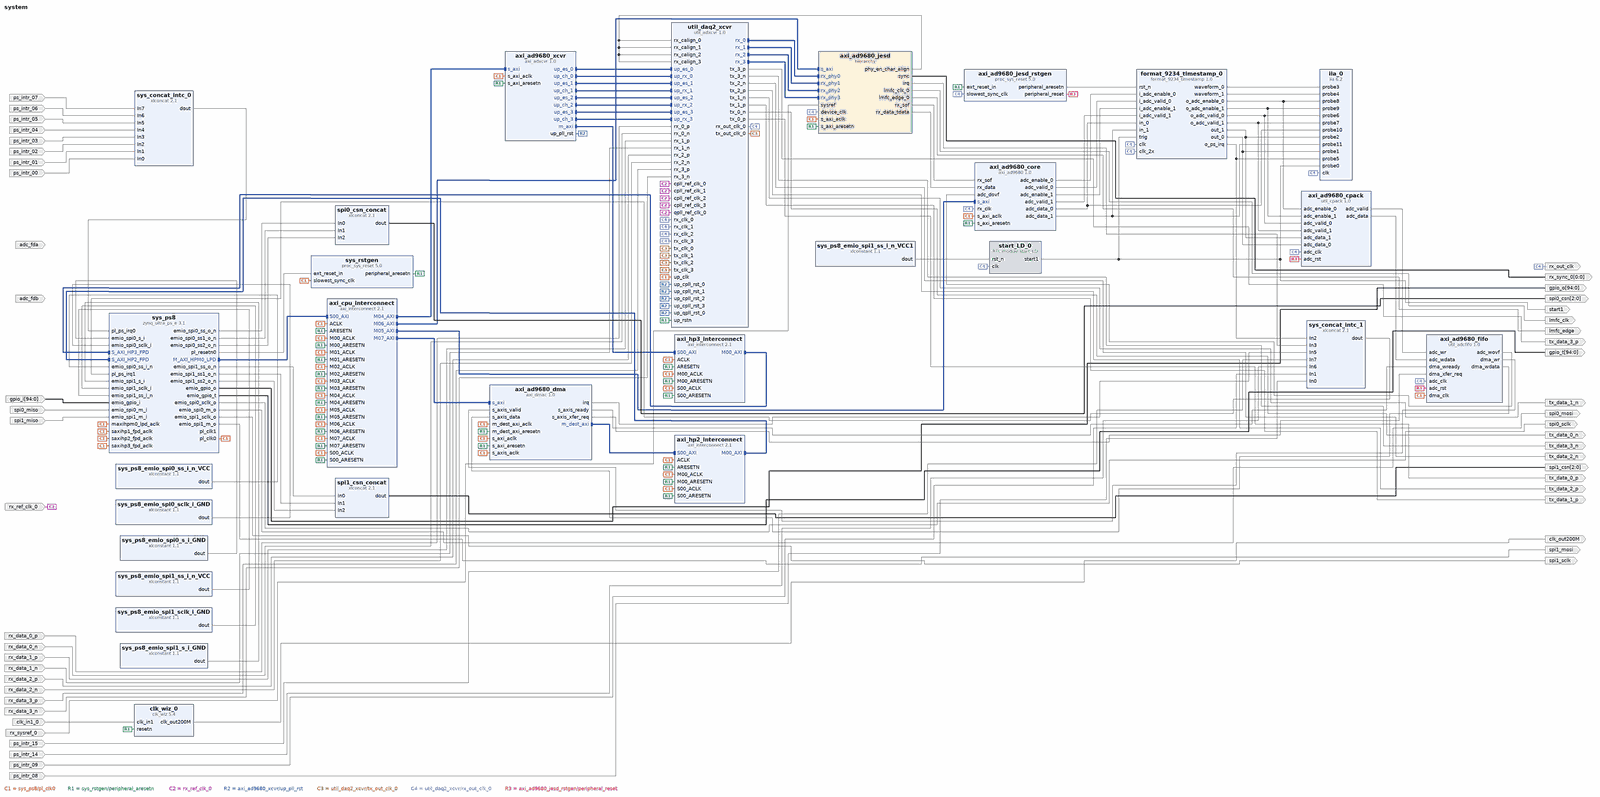
[diagram p0: block diagram of the top level, whole]
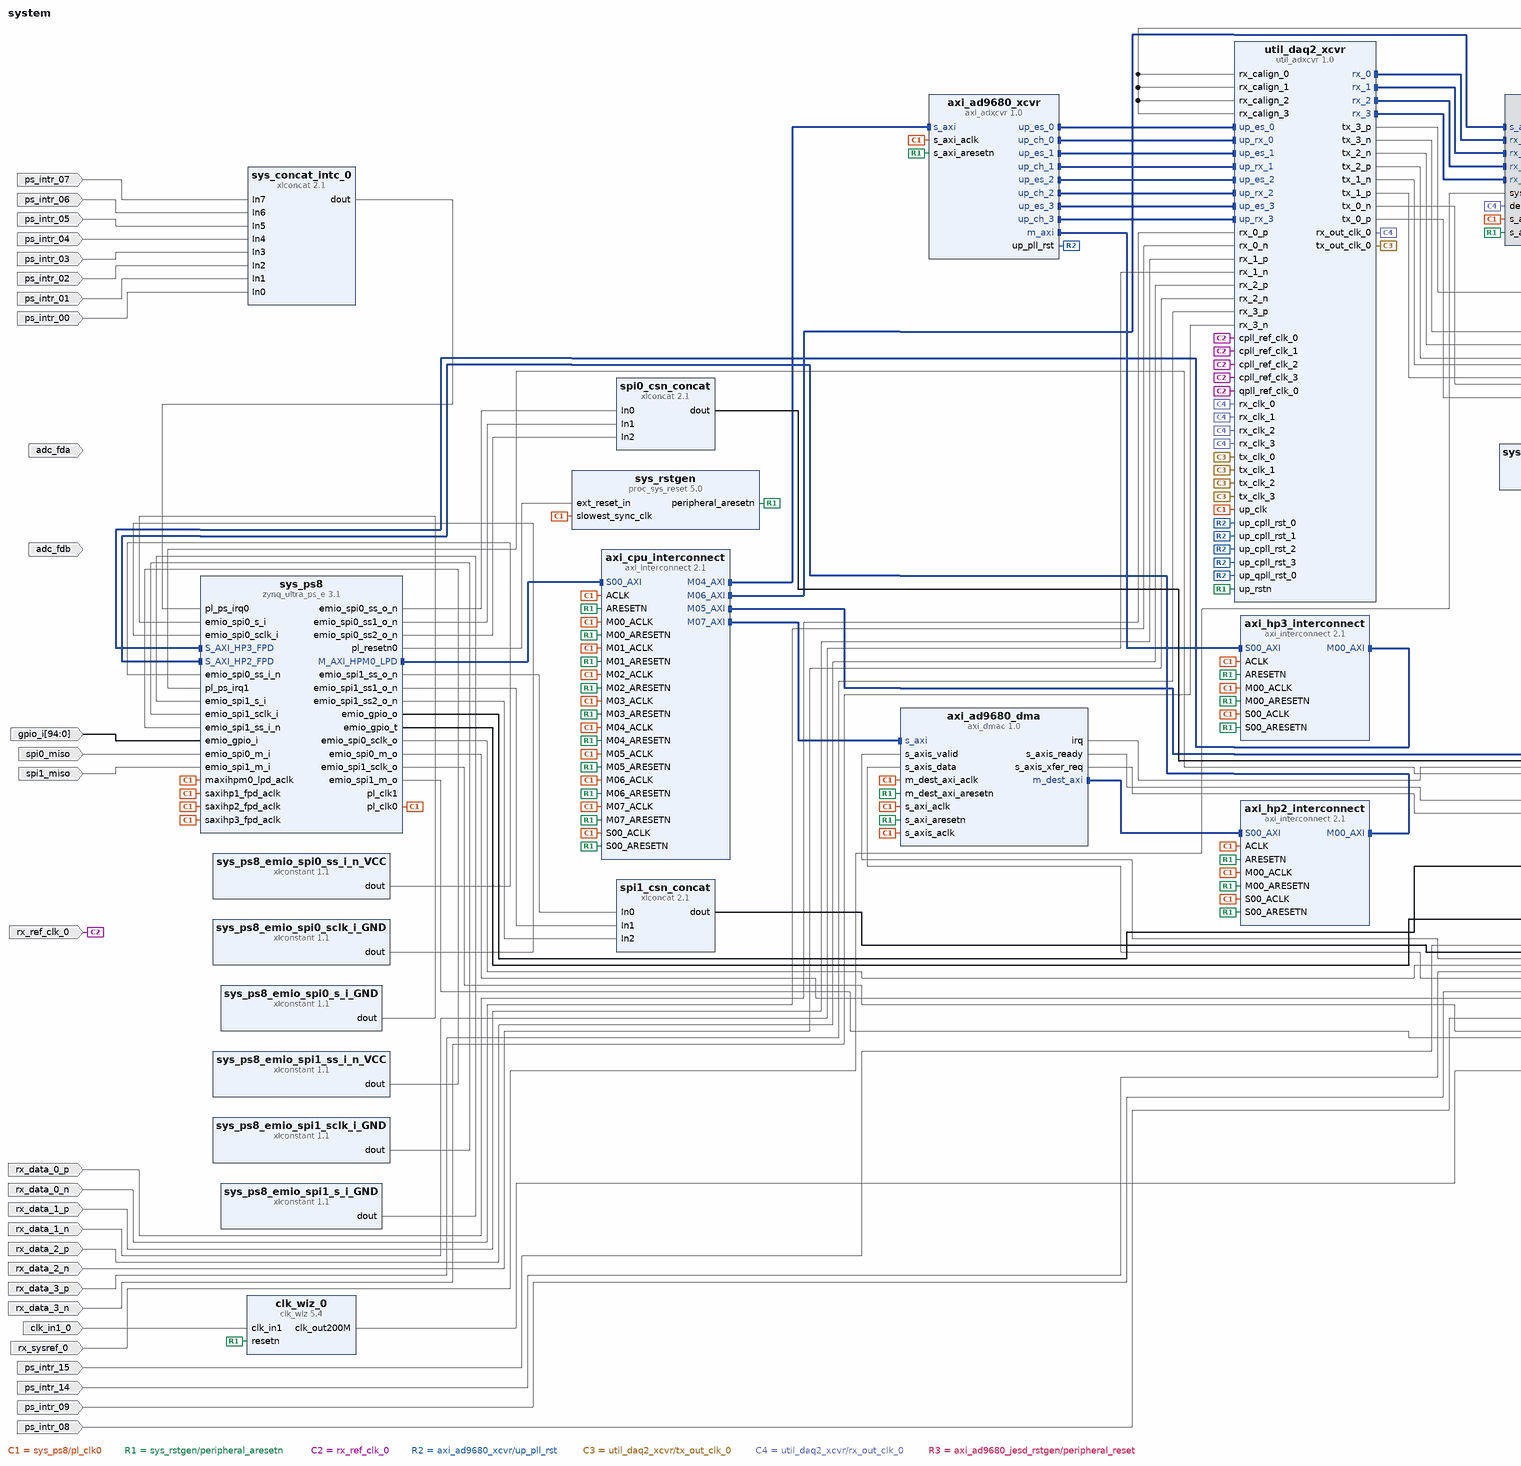
[diagram p1: block diagram of the top level, left part]
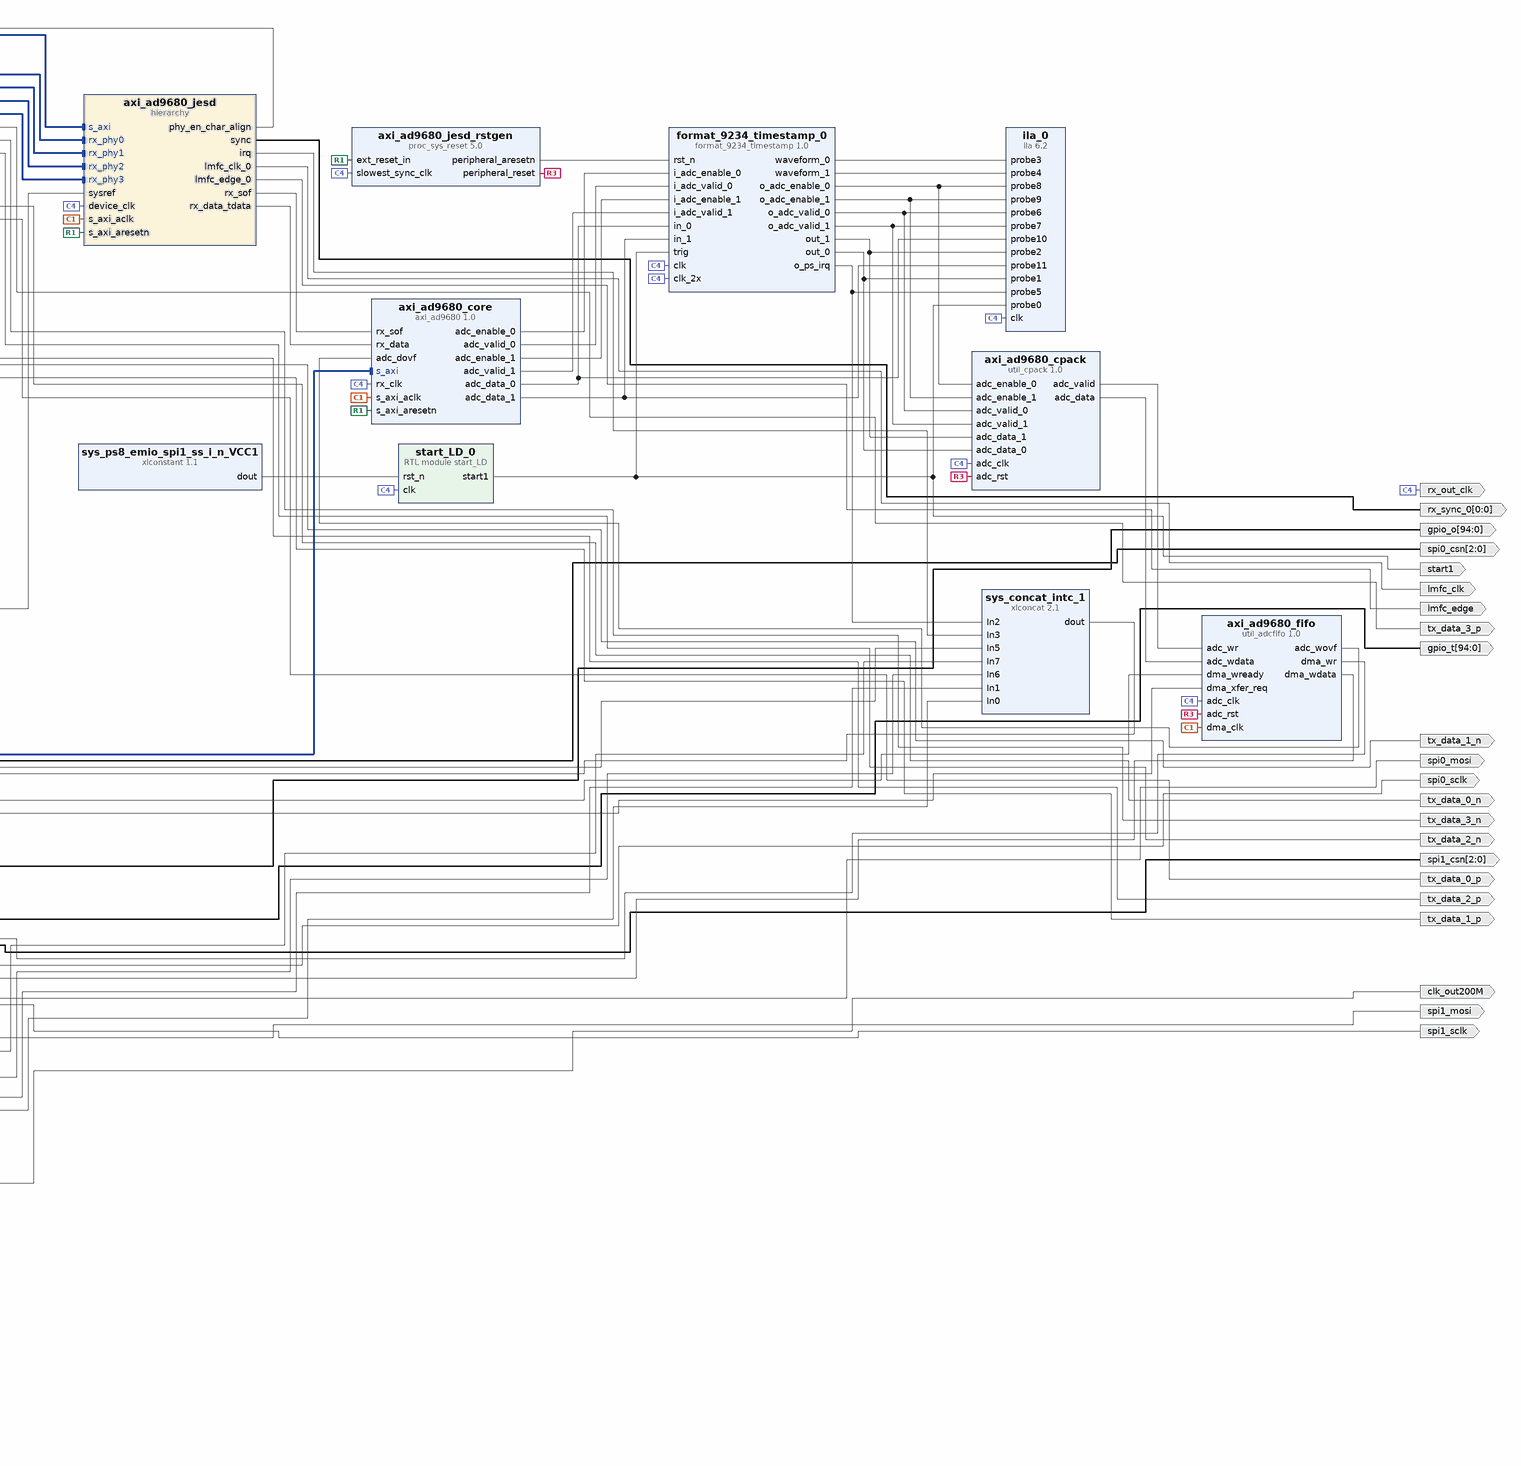
[diagram p2: block diagram of the top level, right part]
# Vivado block design system, xczu9eg-ffvb1156-2-e, Vivado 2017.4
create_bd_design system

create_bd_port -dir I -from 94 -to 0 gpio_i
create_bd_port -dir O -from 94 -to 0 gpio_o
create_bd_port -dir O -from 94 -to 0 gpio_t
create_bd_port -dir O -from 2 -to 0 spi0_csn
create_bd_port -dir O spi0_sclk
create_bd_port -dir O spi0_mosi
create_bd_port -dir I spi0_miso
create_bd_port -dir O -from 2 -to 0 spi1_csn
create_bd_port -dir O spi1_sclk
create_bd_port -dir O spi1_mosi
create_bd_port -dir I spi1_miso
create_bd_port -dir I -type intr ps_intr_15
create_bd_port -dir I -type intr ps_intr_14
create_bd_port -dir I -type intr ps_intr_09
create_bd_port -dir I -type intr ps_intr_08
create_bd_port -dir I -type intr ps_intr_07
create_bd_port -dir I -type intr ps_intr_06
create_bd_port -dir I -type intr ps_intr_05
create_bd_port -dir I -type intr ps_intr_04
create_bd_port -dir I -type intr ps_intr_03
create_bd_port -dir I -type intr ps_intr_02
create_bd_port -dir I -type intr ps_intr_01
create_bd_port -dir I -type intr ps_intr_00
create_bd_port -dir I rx_ref_clk_0
create_bd_port -dir O tx_data_3_p
create_bd_port -dir O tx_data_3_n
create_bd_port -dir O -type clk rx_out_clk
create_bd_port -dir I rx_data_0_p
create_bd_port -dir I rx_data_0_n
create_bd_port -dir I rx_data_1_p
create_bd_port -dir I rx_data_1_n
create_bd_port -dir I rx_data_2_p
create_bd_port -dir I rx_data_2_n
create_bd_port -dir I rx_data_3_p
create_bd_port -dir I rx_data_3_n
create_bd_port -dir I rx_sysref_0
create_bd_port -dir O -from 0 -to 0 rx_sync_0
create_bd_port -dir O -type data start1
create_bd_port -dir O tx_data_2_n
create_bd_port -dir O tx_data_2_p
create_bd_port -dir O tx_data_1_n
create_bd_port -dir O tx_data_1_p
create_bd_port -dir O tx_data_0_n
create_bd_port -dir O tx_data_0_p
create_bd_port -dir O -type clk clk_out200M
set_property -dict {CONFIG.FREQ_HZ 200000000} [get_bd_ports clk_out200M]
create_bd_port -dir I -type clk clk_in1_0
create_bd_port -dir I adc_fda
create_bd_port -dir I adc_fdb
create_bd_port -dir O lmfc_clk
create_bd_port -dir O lmfc_edge

create_bd_cell -type ip -vlnv xilinx.com:ip:zynq_ultra_ps_e:3.1 sys_ps8
set_property -dict [list \
  CONFIG.PSU__PSS_REF_CLK__FREQMHZ 33.330 \
  CONFIG.PSU__CAN1__PERIPHERAL__ENABLE 1 \
  CONFIG.PSU__CAN1__PERIPHERAL__IO {MIO 24 .. 25} \
  CONFIG.PSU__DPAUX__PERIPHERAL__ENABLE 1 \
  CONFIG.PSU__DPAUX__PERIPHERAL__IO {MIO 27 .. 30} \
  CONFIG.PSU__GEM__TSU__ENABLE 0 \
  CONFIG.PSU__FPGA_PL0_ENABLE 1 \
  CONFIG.PSU__FPGA_PL1_ENABLE 1 \
  CONFIG.PSU__ENET3__PERIPHERAL__ENABLE 1 \
  CONFIG.PSU__ENET3__FIFO__ENABLE 0 \
  CONFIG.PSU__ENET3__PTP__ENABLE 0 \
  CONFIG.PSU__ENET3__PERIPHERAL__IO {MIO 64 .. 75} \
  CONFIG.PSU__ENET3__GRP_MDIO__ENABLE 1 \
  CONFIG.PSU__ENET3__GRP_MDIO__IO {MIO 76 .. 77} \
  CONFIG.PSU__GPIO_EMIO__PERIPHERAL__ENABLE 1 \
  CONFIG.PSU__GPIO_EMIO__PERIPHERAL__IO 95 \
  CONFIG.PSU__GPIO0_MIO__PERIPHERAL__ENABLE 1 \
  CONFIG.PSU__GPIO0_MIO__IO {MIO 0 .. 25} \
  CONFIG.PSU__GPIO1_MIO__PERIPHERAL__ENABLE 1 \
  CONFIG.PSU__GPIO1_MIO__IO {MIO 26 .. 51} \
  CONFIG.PSU__I2C0__PERIPHERAL__ENABLE 1 \
  CONFIG.PSU__I2C0__PERIPHERAL__IO {MIO 14 .. 15} \
  CONFIG.PSU__I2C1__PERIPHERAL__ENABLE 1 \
  CONFIG.PSU__I2C1__PERIPHERAL__IO {MIO 16 .. 17} \
  CONFIG.PSU__PCIE__PERIPHERAL__ENABLE 1 \
  CONFIG.PSU__PCIE__PERIPHERAL__ENDPOINT_ENABLE 0 \
  CONFIG.PSU__PCIE__PERIPHERAL__ROOTPORT_ENABLE 1 \
  CONFIG.PSU__PCIE__PERIPHERAL__ROOTPORT_IO {MIO 31} \
  CONFIG.PSU__PCIE__LANE0__ENABLE 1 \
  CONFIG.PSU__PCIE__LANE0__IO {GT Lane0} \
  CONFIG.PSU__GT__LINK_SPEED HBR \
  CONFIG.PSU__GT__VLT_SWNG_LVL_4 0 \
  CONFIG.PSU__GT__PRE_EMPH_LVL_4 0 \
  CONFIG.PSU__USB0__REF_CLK_SEL {Ref Clk2} \
  CONFIG.PSU__USB0__REF_CLK_FREQ 26 \
  CONFIG.PSU__DP__REF_CLK_SEL {Ref Clk3} \
  CONFIG.PSU__DP__REF_CLK_FREQ 27 \
  CONFIG.PSU__SATA__REF_CLK_SEL {Ref Clk1} \
  CONFIG.PSU__SATA__REF_CLK_FREQ 125 \
  CONFIG.PSU__PCIE__REF_CLK_SEL {Ref Clk0} \
  CONFIG.PSU__PCIE__REF_CLK_FREQ 100 \
  CONFIG.PSU__DP__LANE_SEL {Single Lower} \
  CONFIG.PSU__PCIE__DEVICE_PORT_TYPE {Root Port} \
  CONFIG.PSU__PCIE__MAXIMUM_LINK_WIDTH x1 \
  CONFIG.PSU__PCIE__LINK_SPEED {5.0 Gb/s} \
  CONFIG.PSU__PCIE__BAR0_VAL 0x0 \
  CONFIG.PSU__PCIE__BAR1_VAL 0x0 \
  CONFIG.PSU__PCIE__BAR2_VAL 0x0 \
  CONFIG.PSU__PCIE__BAR3_VAL 0x0 \
  CONFIG.PSU__PCIE__BAR4_VAL 0x0 \
  CONFIG.PSU__PCIE__BAR5_VAL 0x0 \
  CONFIG.PSU__PCIE__EROM_VAL 0x0 \
  CONFIG.PSU__PCIE__MAX_PAYLOAD_SIZE {256 bytes} \
  CONFIG.PSU__PCIE__VENDOR_ID 0x10EE \
  CONFIG.PSU__PCIE__DEVICE_ID 0xD021 \
  CONFIG.PSU__PCIE__REVISION_ID 0x0 \
  CONFIG.PSU__PCIE__SUBSYSTEM_VENDOR_ID 0x10EE \
  CONFIG.PSU__PCIE__SUBSYSTEM_ID 0x7 \
  CONFIG.PSU__PCIE__CLASS_CODE_BASE 0x06 \
  CONFIG.PSU__PCIE__CLASS_CODE_SUB 0x4 \
  CONFIG.PSU__PCIE__CLASS_CODE_INTERFACE 0x0 \
  CONFIG.PSU__PCIE__CLASS_CODE_VALUE 0x60400 \
  CONFIG.PSU__PCIE__CRS_SW_VISIBILITY 1 \
  CONFIG.PSU__PMU__AIBACK__ENABLE 0 \
  CONFIG.PSU__PMU__PLERROR__ENABLE 0 \
  CONFIG.PSU__PMU__PERIPHERAL__ENABLE 1 \
  CONFIG.PSU__PMU__EMIO_GPI__ENABLE 0 \
  CONFIG.PSU__PMU__EMIO_GPO__ENABLE 0 \
  CONFIG.PSU__PMU__GPI0__ENABLE 0 \
  CONFIG.PSU__PMU__GPI1__ENABLE 0 \
  CONFIG.PSU__PMU__GPI2__ENABLE 0 \
  CONFIG.PSU__PMU__GPI3__ENABLE 0 \
  CONFIG.PSU__PMU__GPI4__ENABLE 0 \
  CONFIG.PSU__PMU__GPI5__ENABLE 0 \
  CONFIG.PSU__PMU__GPO0__ENABLE 1 \
  CONFIG.PSU__PMU__GPO1__ENABLE 1 \
  CONFIG.PSU__PMU__GPO2__ENABLE 1 \
  CONFIG.PSU__PMU__GPO3__ENABLE 1 \
  CONFIG.PSU__PMU__GPO4__ENABLE 1 \
  CONFIG.PSU__PMU__GPO5__ENABLE 1 \
  CONFIG.PSU__PMU__GPO0__IO {MIO 32} \
  CONFIG.PSU__PMU__GPO1__IO {MIO 33} \
  CONFIG.PSU__PMU__GPO2__IO {MIO 34} \
  CONFIG.PSU__PMU__GPO3__IO {MIO 35} \
  CONFIG.PSU__PMU__GPO4__IO {MIO 36} \
  CONFIG.PSU__PMU__GPO5__IO {MIO 37} \
  CONFIG.PSU__QSPI__PERIPHERAL__ENABLE 1 \
  CONFIG.PSU__QSPI__PERIPHERAL__IO {MIO 0 .. 12} \
  CONFIG.PSU__QSPI__PERIPHERAL__MODE {Dual Parallel} \
  CONFIG.PSU__QSPI__PERIPHERAL__DATA_MODE x4 \
  CONFIG.PSU__QSPI__GRP_FBCLK__ENABLE 1 \
  CONFIG.PSU__QSPI__GRP_FBCLK__IO {MIO 6} \
  CONFIG.PSU__SD1__PERIPHERAL__ENABLE 1 \
  CONFIG.PSU__SD1__PERIPHERAL__IO {MIO 39 .. 51} \
  CONFIG.PSU__SD1__GRP_CD__ENABLE 1 \
  CONFIG.PSU__SD1__GRP_CD__IO {MIO 45} \
  CONFIG.PSU__SD1__GRP_POW__ENABLE 0 \
  CONFIG.PSU__SD1__GRP_WP__ENABLE 1 \
  CONFIG.PSU__SD1__GRP_WP__IO {MIO 44} \
  CONFIG.PSU__SD1__SLOT_TYPE {SD 3.0} \
  CONFIG.PSU__SD1__DATA_TRANSFER_MODE 8Bit \
  CONFIG.PSU__SPI0__PERIPHERAL__ENABLE 1 \
  CONFIG.PSU__SPI0__PERIPHERAL__IO EMIO \
  CONFIG.PSU__SPI0__GRP_SS0__IO EMIO \
  CONFIG.PSU__SPI0__GRP_SS1__ENABLE 1 \
  CONFIG.PSU__SPI0__GRP_SS1__IO EMIO \
  CONFIG.PSU__SPI0__GRP_SS2__ENABLE 1 \
  CONFIG.PSU__SPI0__GRP_SS2__IO EMIO \
  CONFIG.PSU__SPI1__PERIPHERAL__ENABLE 1 \
  CONFIG.PSU__SPI1__PERIPHERAL__IO EMIO \
  CONFIG.PSU__SPI1__GRP_SS0__IO EMIO \
  CONFIG.PSU__SPI1__GRP_SS1__ENABLE 1 \
  CONFIG.PSU__SPI1__GRP_SS1__IO EMIO \
  CONFIG.PSU__SPI1__GRP_SS2__ENABLE 1 \
  CONFIG.PSU__SPI1__GRP_SS2__IO EMIO \
  CONFIG.PSU__SWDT0__PERIPHERAL__ENABLE 1 \
  CONFIG.PSU__SWDT0__CLOCK__ENABLE 0 \
  CONFIG.PSU__SWDT0__RESET__ENABLE 0 \
  CONFIG.PSU__SWDT1__PERIPHERAL__ENABLE 1 \
  CONFIG.PSU__SWDT1__CLOCK__ENABLE 0 \
  CONFIG.PSU__SWDT1__RESET__ENABLE 0 \
  CONFIG.PSU__UART0__BAUD_RATE 115200 \
  CONFIG.PSU__TTC0__PERIPHERAL__ENABLE 1 \
  CONFIG.PSU__TTC0__CLOCK__ENABLE 0 \
  CONFIG.PSU__TTC0__WAVEOUT__ENABLE 0 \
  CONFIG.PSU__TTC1__PERIPHERAL__ENABLE 1 \
  CONFIG.PSU__UART1__BAUD_RATE 115200 \
  CONFIG.PSU__TTC1__CLOCK__ENABLE 0 \
  CONFIG.PSU__TTC1__WAVEOUT__ENABLE 0 \
  CONFIG.PSU__TTC2__PERIPHERAL__ENABLE 1 \
  CONFIG.PSU__TTC2__CLOCK__ENABLE 0 \
  CONFIG.PSU__TTC2__WAVEOUT__ENABLE 0 \
  CONFIG.PSU__TTC3__PERIPHERAL__ENABLE 1 \
  CONFIG.PSU__TTC3__CLOCK__ENABLE 0 \
  CONFIG.PSU__TTC3__WAVEOUT__ENABLE 0 \
  CONFIG.PSU__CSUPMU__PERIPHERAL__VALID 1 \
  CONFIG.PSU__DDRC__BUS_WIDTH {64 Bit} \
  CONFIG.PSU__DDRC__DEVICE_CAPACITY {4096 MBits} \
  CONFIG.PSU__DDRC__DRAM_WIDTH {8 Bits} \
  CONFIG.PSU__DDRC__ECC Disabled \
  CONFIG.PSU__DDRC__MEMORY_TYPE {DDR 4} \
  CONFIG.PSU__DDRC__SPEED_BIN DDR4_2133P \
  CONFIG.PSU__DDRC__COMPONENTS UDIMM \
  CONFIG.PSU__UART0__PERIPHERAL__ENABLE 1 \
  CONFIG.PSU__UART0__PERIPHERAL__IO {MIO 18 .. 19} \
  CONFIG.PSU__UART0__MODEM__ENABLE 0 \
  CONFIG.PSU__UART1__PERIPHERAL__ENABLE 1 \
  CONFIG.PSU__UART1__PERIPHERAL__IO {MIO 20 .. 21} \
  CONFIG.PSU__UART1__MODEM__ENABLE 0 \
  CONFIG.PSU__USB0__PERIPHERAL__ENABLE 1 \
  CONFIG.PSU__USB0__PERIPHERAL__IO {MIO 52 .. 63} \
  CONFIG.PSU__USB3_0__PERIPHERAL__ENABLE 1 \
  CONFIG.PSU__USB3_0__PERIPHERAL__IO {GT Lane2} \
  CONFIG.PSU__USB3_0__EMIO__ENABLE 0 \
  CONFIG.PSU__USB2_0__EMIO__ENABLE 0 \
  CONFIG.PSU__USE__M_AXI_GP0 0 \
  CONFIG.PSU__USE__M_AXI_GP1 0 \
  CONFIG.PSU__USE__M_AXI_GP2 1 \
  CONFIG.PSU__USE__S_AXI_GP3 1 \
  CONFIG.PSU__USE__S_AXI_GP4 1 \
  CONFIG.PSU__USE__S_AXI_GP5 1 \
  CONFIG.PSU__USE__IRQ0 1 \
  CONFIG.PSU__USE__IRQ1 1 \
  CONFIG.PSU__PRESET_APPLIED 1 \
  CONFIG.PSU__DDR_HIGH_ADDRESS_GUI_ENABLE 1 \
  CONFIG.PSU_BANK_0_IO_STANDARD LVCMOS18 \
  CONFIG.PSU_BANK_1_IO_STANDARD LVCMOS18 \
  CONFIG.PSU_BANK_2_IO_STANDARD LVCMOS18 \
  CONFIG.PSU__DISPLAYPORT__PERIPHERAL__ENABLE 1 \
  CONFIG.PSU__DISPLAYPORT__LANE0__ENABLE 1 \
  CONFIG.PSU__DISPLAYPORT__LANE0__IO {GT Lane1} \
  CONFIG.PSU__DISPLAYPORT__LANE1__ENABLE 0 \
  CONFIG.PSU__SATA__PERIPHERAL__ENABLE 1 \
  CONFIG.PSU__SATA__LANE1__IO {GT Lane3} \
  CONFIG.PSU__CRL_APB__USB3__ENABLE 1 \
  CONFIG.PSU__CRF_APB__APLL_CTRL__SRCSEL PSS_REF_CLK \
  CONFIG.PSU__CRF_APB__DPLL_CTRL__SRCSEL PSS_REF_CLK \
  CONFIG.PSU__CRF_APB__VPLL_CTRL__SRCSEL PSS_REF_CLK \
  CONFIG.PSU__CRF_APB__ACPU_CTRL__SRCSEL APLL \
  CONFIG.PSU__CRF_APB__DBG_TRACE_CTRL__SRCSEL IOPLL \
  CONFIG.PSU__CRF_APB__DBG_FPD_CTRL__SRCSEL IOPLL \
  CONFIG.PSU__CRF_APB__DP_VIDEO_REF_CTRL__SRCSEL VPLL \
  CONFIG.PSU__CRF_APB__DP_AUDIO_REF_CTRL__SRCSEL RPLL \
  CONFIG.PSU__CRF_APB__DP_STC_REF_CTRL__SRCSEL RPLL \
  CONFIG.PSU__CRF_APB__DDR_CTRL__SRCSEL DPLL \
  CONFIG.PSU__CRF_APB__GPU_REF_CTRL__SRCSEL IOPLL \
  CONFIG.PSU__CRL_APB__PL0_REF_CTRL__SRCSEL IOPLL \
  CONFIG.PSU__CRL_APB__PL1_REF_CTRL__SRCSEL IOPLL \
  CONFIG.PSU__CRF_APB__GDMA_REF_CTRL__SRCSEL APLL \
  CONFIG.PSU__CRF_APB__DPDMA_REF_CTRL__SRCSEL APLL \
  CONFIG.PSU__CRF_APB__TOPSW_MAIN_CTRL__SRCSEL DPLL \
  CONFIG.PSU__CRF_APB__TOPSW_LSBUS_CTRL__SRCSEL IOPLL \
  CONFIG.PSU__CRF_APB__DBG_TSTMP_CTRL__SRCSEL IOPLL \
  CONFIG.PSU__CRL_APB__IOPLL_CTRL__SRCSEL PSS_REF_CLK \
  CONFIG.PSU__CRL_APB__RPLL_CTRL__SRCSEL PSS_REF_CLK \
  CONFIG.PSU__CRL_APB__GEM3_REF_CTRL__SRCSEL IOPLL \
  CONFIG.PSU__CRL_APB__USB0_BUS_REF_CTRL__SRCSEL IOPLL \
  CONFIG.PSU__CRL_APB__QSPI_REF_CTRL__SRCSEL IOPLL \
  CONFIG.PSU__CRL_APB__SDIO1_REF_CTRL__SRCSEL IOPLL \
  CONFIG.PSU__CRL_APB__UART0_REF_CTRL__SRCSEL IOPLL \
  CONFIG.PSU__CRL_APB__UART1_REF_CTRL__SRCSEL IOPLL \
  CONFIG.PSU__CRL_APB__I2C0_REF_CTRL__SRCSEL IOPLL \
  CONFIG.PSU__CRL_APB__I2C1_REF_CTRL__SRCSEL IOPLL \
  CONFIG.PSU__CRL_APB__CAN1_REF_CTRL__SRCSEL IOPLL \
  CONFIG.PSU__CRL_APB__CPU_R5_CTRL__SRCSEL IOPLL \
  CONFIG.PSU__CRL_APB__IOU_SWITCH_CTRL__SRCSEL IOPLL \
  CONFIG.PSU__CRL_APB__PCAP_CTRL__SRCSEL IOPLL \
  CONFIG.PSU__CRL_APB__LPD_LSBUS_CTRL__SRCSEL IOPLL \
  CONFIG.PSU__CRL_APB__LPD_SWITCH_CTRL__SRCSEL IOPLL \
  CONFIG.PSU__CRL_APB__DBG_LPD_CTRL__SRCSEL IOPLL \
  CONFIG.PSU__CRL_APB__ADMA_REF_CTRL__SRCSEL IOPLL \
  CONFIG.PSU__CRL_APB__TIMESTAMP_REF_CTRL__SRCSEL IOPLL \
  CONFIG.PSU__CRL_APB__USB3_DUAL_REF_CTRL__SRCSEL IOPLL \
  CONFIG.PSU__IOU_SLCR__IOU_TTC_APB_CLK__TTC0_SEL APB \
  CONFIG.PSU__IOU_SLCR__IOU_TTC_APB_CLK__TTC1_SEL APB \
  CONFIG.PSU__IOU_SLCR__IOU_TTC_APB_CLK__TTC2_SEL APB \
  CONFIG.PSU__IOU_SLCR__IOU_TTC_APB_CLK__TTC3_SEL APB \
  CONFIG.PSU__OVERRIDE__BASIC_CLOCK 0 \
  CONFIG.PSU__DLL__ISUSED 1 \
  CONFIG.PSU__DDR__INTERFACE__FREQMHZ 533.500 \
  CONFIG.PSU__CRF_APB__ACPU_CTRL__FREQMHZ 1200 \
  CONFIG.PSU__CRF_APB__DBG_TRACE_CTRL__FREQMHZ 250 \
  CONFIG.PSU__CRF_APB__DBG_FPD_CTRL__FREQMHZ 250 \
  CONFIG.PSU__CRF_APB__DDR_CTRL__FREQMHZ 1067 \
  CONFIG.PSU__CRF_APB__GPU_REF_CTRL__FREQMHZ 500 \
  CONFIG.PSU__CRL_APB__PL0_REF_CTRL__FREQMHZ 100 \
  CONFIG.PSU__CRL_APB__PL1_REF_CTRL__FREQMHZ 200 \
  CONFIG.PSU__CRF_APB__GDMA_REF_CTRL__FREQMHZ 600 \
  CONFIG.PSU__CRF_APB__DPDMA_REF_CTRL__FREQMHZ 600 \
  CONFIG.PSU__CRF_APB__TOPSW_MAIN_CTRL__FREQMHZ 533.33 \
  CONFIG.PSU__CRF_APB__TOPSW_LSBUS_CTRL__FREQMHZ 100 \
  CONFIG.PSU__CRF_APB__DBG_TSTMP_CTRL__FREQMHZ 250 \
  CONFIG.PSU__CRL_APB__GEM3_REF_CTRL__FREQMHZ 125 \
  CONFIG.PSU__CRL_APB__USB0_BUS_REF_CTRL__FREQMHZ 250 \
  CONFIG.PSU__CRL_APB__QSPI_REF_CTRL__FREQMHZ 125 \
  CONFIG.PSU__CRL_APB__SDIO1_REF_CTRL__FREQMHZ 200 \
  CONFIG.PSU__CRL_APB__UART0_REF_CTRL__FREQMHZ 100 \
  CONFIG.PSU__CRL_APB__UART1_REF_CTRL__FREQMHZ 100 \
  CONFIG.PSU__CRL_APB__I2C0_REF_CTRL__FREQMHZ 100 \
  CONFIG.PSU__CRL_APB__I2C1_REF_CTRL__FREQMHZ 100 \
  CONFIG.PSU__CRL_APB__SPI0_REF_CTRL__FREQMHZ 100 \
  CONFIG.PSU__CRL_APB__SPI1_REF_CTRL__FREQMHZ 100 \
  CONFIG.PSU__CRL_APB__CAN1_REF_CTRL__FREQMHZ 100 \
  CONFIG.PSU__CRL_APB__CPU_R5_CTRL__FREQMHZ 500 \
  CONFIG.PSU__CRL_APB__IOU_SWITCH_CTRL__FREQMHZ 250 \
  CONFIG.PSU__CRL_APB__PCAP_CTRL__FREQMHZ 200 \
  CONFIG.PSU__CRL_APB__LPD_LSBUS_CTRL__FREQMHZ 100 \
  CONFIG.PSU__CRL_APB__LPD_SWITCH_CTRL__FREQMHZ 500 \
  CONFIG.PSU__CRL_APB__DBG_LPD_CTRL__FREQMHZ 250 \
  CONFIG.PSU__CRL_APB__ADMA_REF_CTRL__FREQMHZ 500 \
  CONFIG.PSU__CRL_APB__TIMESTAMP_REF_CTRL__FREQMHZ 100 \
  CONFIG.PSU__CRL_APB__USB3_DUAL_REF_CTRL__FREQMHZ 20 \
  CONFIG.PSU__GPIO_EMIO_WIDTH 95 \
  CONFIG.PSU__PMU_COHERENCY 0 \
  CONFIG.PSU__USB0_COHERENCY 0 \
  CONFIG.PSU__SD1_COHERENCY 0 \
  CONFIG.PSU__QSPI_COHERENCY 0 \
  CONFIG.PSU__ENET3__TSU__ENABLE 0 \
  CONFIG.PSU__GEM3_COHERENCY 0 \
] [get_bd_cells sys_ps8]
# 108 more settings of sys_ps8 are not shown: defaults, MIO pin electricals, DDR timing, and values the tool derives
create_bd_cell -type ip -vlnv xilinx.com:ip:proc_sys_reset:5.0 sys_rstgen
set_property -dict {CONFIG.C_EXT_RST_WIDTH 1} [get_bd_cells sys_rstgen]
create_bd_cell -type ip -vlnv xilinx.com:ip:xlconcat:2.1 spi0_csn_concat
set_property -dict {CONFIG.NUM_PORTS 3} [get_bd_cells spi0_csn_concat]
create_bd_cell -type ip -vlnv xilinx.com:ip:xlconstant:1.1 sys_ps8_emio_spi0_ss_i_n_VCC
set_property -dict {CONFIG.CONST_WIDTH 1 CONFIG.CONST_VAL -1} [get_bd_cells sys_ps8_emio_spi0_ss_i_n_VCC]
create_bd_cell -type ip -vlnv xilinx.com:ip:xlconstant:1.1 sys_ps8_emio_spi0_sclk_i_GND
set_property -dict {CONFIG.CONST_WIDTH 1 CONFIG.CONST_VAL 0} [get_bd_cells sys_ps8_emio_spi0_sclk_i_GND]
create_bd_cell -type ip -vlnv xilinx.com:ip:xlconstant:1.1 sys_ps8_emio_spi0_s_i_GND
set_property -dict {CONFIG.CONST_WIDTH 1 CONFIG.CONST_VAL 0} [get_bd_cells sys_ps8_emio_spi0_s_i_GND]
create_bd_cell -type ip -vlnv xilinx.com:ip:xlconcat:2.1 spi1_csn_concat
set_property -dict {CONFIG.NUM_PORTS 3} [get_bd_cells spi1_csn_concat]
create_bd_cell -type ip -vlnv xilinx.com:ip:xlconstant:1.1 sys_ps8_emio_spi1_ss_i_n_VCC
set_property -dict {CONFIG.CONST_WIDTH 1 CONFIG.CONST_VAL -1} [get_bd_cells sys_ps8_emio_spi1_ss_i_n_VCC]
create_bd_cell -type ip -vlnv xilinx.com:ip:xlconstant:1.1 sys_ps8_emio_spi1_sclk_i_GND
set_property -dict {CONFIG.CONST_WIDTH 1 CONFIG.CONST_VAL 0} [get_bd_cells sys_ps8_emio_spi1_sclk_i_GND]
create_bd_cell -type ip -vlnv xilinx.com:ip:xlconstant:1.1 sys_ps8_emio_spi1_s_i_GND
set_property -dict {CONFIG.CONST_WIDTH 1 CONFIG.CONST_VAL 0} [get_bd_cells sys_ps8_emio_spi1_s_i_GND]
create_bd_cell -type ip -vlnv xilinx.com:ip:xlconcat:2.1 sys_concat_intc_0
set_property -dict {CONFIG.NUM_PORTS 8} [get_bd_cells sys_concat_intc_0]
create_bd_cell -type ip -vlnv xilinx.com:ip:xlconcat:2.1 sys_concat_intc_1
set_property -dict {CONFIG.NUM_PORTS 8} [get_bd_cells sys_concat_intc_1]
create_bd_cell -type ip -vlnv analog.com:user:util_adcfifo:1.0 axi_ad9680_fifo
set_property -dict [list \
  CONFIG.ADC_DATA_WIDTH 128 \
  CONFIG.DMA_DATA_WIDTH 64 \
  CONFIG.DMA_READY_ENABLE 1 \
  CONFIG.DMA_ADDRESS_WIDTH 16 \
] [get_bd_cells axi_ad9680_fifo]
create_bd_cell -type ip -vlnv analog.com:user:axi_adxcvr:1.0 axi_ad9680_xcvr
set_property -dict [list \
  CONFIG.NUM_OF_LANES 4 \
  CONFIG.XCVR_TYPE 2 \
  CONFIG.TX_OR_RX_N 0 \
  CONFIG.QPLL_ENABLE 0 \
  CONFIG.OUT_CLK_SEL {"011"} \
] [get_bd_cells axi_ad9680_xcvr]
create_bd_cell -type hier axi_ad9680_jesd
create_bd_cell -type ip -vlnv analog.com:user:axi_ad9680:1.0 axi_ad9680_core
create_bd_cell -type ip -vlnv analog.com:user:util_cpack:1.0 axi_ad9680_cpack
set_property -dict {CONFIG.CHANNEL_DATA_WIDTH 64 CONFIG.NUM_OF_CHANNELS 2} [get_bd_cells axi_ad9680_cpack]
create_bd_cell -type ip -vlnv analog.com:user:axi_dmac:1.0 axi_ad9680_dma
set_property -dict [list \
  CONFIG.ID 0 \
  CONFIG.DMA_DATA_WIDTH_SRC 64 \
  CONFIG.DMA_DATA_WIDTH_DEST 64 \
  CONFIG.DMA_LENGTH_WIDTH 24 \
  CONFIG.DMA_2D_TRANSFER false \
  CONFIG.AXI_SLICE_DEST false \
  CONFIG.AXI_SLICE_SRC false \
  CONFIG.SYNC_TRANSFER_START false \
  CONFIG.CYCLIC false \
  CONFIG.DMA_TYPE_DEST 0 \
  CONFIG.DMA_TYPE_SRC 1 \
] [get_bd_cells axi_ad9680_dma]
create_bd_cell -type ip -vlnv analog.com:user:util_adxcvr:1.0 util_daq2_xcvr
set_property -dict [list \
  CONFIG.XCVR_TYPE 2 \
  CONFIG.QPLL_REFCLK_DIV 1 \
  CONFIG.QPLL_FBDIV {"0000101000"} \
  CONFIG.TX_NUM_OF_LANES 4 \
  CONFIG.RX_NUM_OF_LANES 4 \
] [get_bd_cells util_daq2_xcvr]
create_bd_cell -type ip -vlnv xilinx.com:ip:proc_sys_reset:5.0 axi_ad9680_jesd_rstgen
create_bd_cell -type ip -vlnv xilinx.com:ip:axi_interconnect:2.1 axi_cpu_interconnect
set_property -dict {CONFIG.NUM_MI 8} [get_bd_cells axi_cpu_interconnect]
create_bd_cell -type ip -vlnv xilinx.com:ip:axi_interconnect:2.1 axi_hp3_interconnect
set_property -dict {CONFIG.NUM_SI 1 CONFIG.NUM_MI 1} [get_bd_cells axi_hp3_interconnect]
create_bd_cell -type ip -vlnv xilinx.com:ip:axi_interconnect:2.1 axi_hp2_interconnect
set_property -dict {CONFIG.NUM_SI 1 CONFIG.NUM_MI 1} [get_bd_cells axi_hp2_interconnect]
create_bd_cell -type ip -vlnv xilinx.com:ip:ila:6.2 ila_0
set_property -dict [list \
  CONFIG.C_PROBE22_WIDTH 1 \
  CONFIG.C_PROBE17_WIDTH 1 \
  CONFIG.C_PROBE16_WIDTH 1 \
  CONFIG.C_PROBE11_WIDTH 64 \
  CONFIG.C_PROBE10_WIDTH 64 \
  CONFIG.C_PROBE4_WIDTH 12 \
  CONFIG.C_PROBE3_WIDTH 12 \
  CONFIG.C_PROBE2_WIDTH 64 \
  CONFIG.C_PROBE0_WIDTH 1 \
  CONFIG.C_DATA_DEPTH 2048 \
  CONFIG.C_NUM_OF_PROBES 12 \
  CONFIG.C_EN_STRG_QUAL 1 \
  CONFIG.C_ADV_TRIGGER true \
  CONFIG.C_PROBE0_MU_CNT 2 \
  CONFIG.ALL_PROBE_SAME_MU_CNT 2 \
  CONFIG.C_ENABLE_ILA_AXI_MON false \
  CONFIG.C_MONITOR_TYPE Native \
] [get_bd_cells ila_0]
create_bd_cell -type ip -vlnv xilinx.com:ip:clk_wiz:5.4 clk_wiz_0
set_property -dict [list \
  CONFIG.ENABLE_CLOCK_MONITOR false \
  CONFIG.PRIMITIVE MMCM \
  CONFIG.CLKIN1_JITTER_PS 100.0 \
  CONFIG.CLKOUT2_USED true \
  CONFIG.NUM_OUT_CLKS 2 \
  CONFIG.CLK_OUT1_PORT clk_out200M \
  CONFIG.CLK_OUT2_PORT clk_out500M \
  CONFIG.CLKOUT1_REQUESTED_OUT_FREQ 200 \
  CONFIG.CLKOUT2_REQUESTED_OUT_FREQ 500 \
  CONFIG.PRIM_SOURCE Single_ended_clock_capable_pin \
  CONFIG.USE_LOCKED false \
  CONFIG.RESET_PORT resetn \
  CONFIG.MMCM_DIVCLK_DIVIDE 1 \
  CONFIG.MMCM_CLKFBOUT_MULT_F 10.000 \
  CONFIG.MMCM_CLKIN1_PERIOD 10.000 \
  CONFIG.MMCM_CLKIN2_PERIOD 10.000 \
  CONFIG.MMCM_CLKOUT0_DIVIDE_F 5.000 \
  CONFIG.MMCM_CLKOUT1_DIVIDE 2 \
  CONFIG.RESET_TYPE ACTIVE_LOW \
  CONFIG.CLK_IN1_BOARD_INTERFACE Custom \
  CONFIG.CLKOUT1_JITTER 114.829 \
  CONFIG.CLKOUT1_PHASE_ERROR 98.575 \
  CONFIG.CLKOUT2_JITTER 97.082 \
  CONFIG.CLKOUT2_PHASE_ERROR 98.575 \
] [get_bd_cells clk_wiz_0]
create_bd_cell -type ip -vlnv zvision:user:format_9234_timestamp:1.0 format_9234_timestamp_0
set_property -dict [list \
  CONFIG.RECV64_CNT 250 \
  CONFIG.TRIGtoRECV_DELAY 0 \
  CONFIG.TRIGtoPSIRQ_DELAY 0 \
] [get_bd_cells format_9234_timestamp_0]
create_bd_cell -type ip -vlnv xilinx.com:ip:xlconstant:1.1 sys_ps8_emio_spi1_ss_i_n_VCC1
set_property -dict {CONFIG.CONST_WIDTH 1 CONFIG.CONST_VAL -1} [get_bd_cells sys_ps8_emio_spi1_ss_i_n_VCC1]
create_bd_cell -type module -reference start_LD start_LD_0
set_property -dict {CONFIG.HIGH_PERIOD 0x00000007 CONFIG.TOTAL_PERIOD 0x0003D090} [get_bd_cells start_LD_0]

# ---- hierarchy /axi_ad9680_jesd ----
current_bd_instance /axi_ad9680_jesd
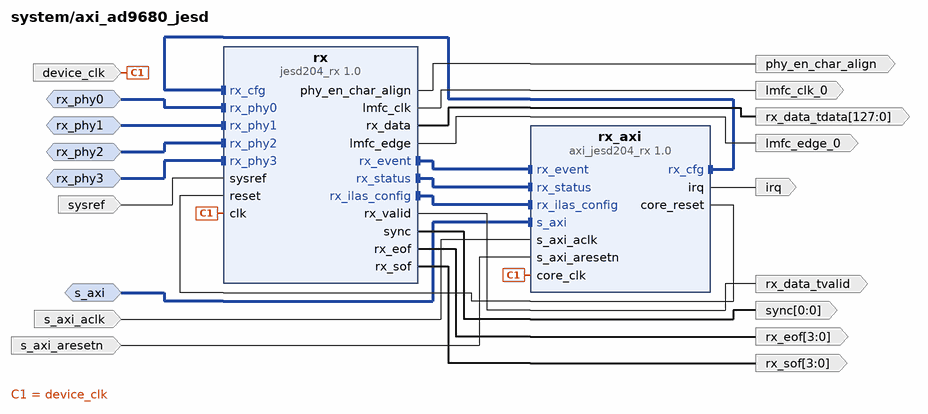
[diagram p3: block diagram inside /axi_ad9680_jesd]
create_bd_intf_pin -mode Slave -vlnv xilinx.com:interface:aximm_rtl:1.0 s_axi
create_bd_intf_pin -mode Slave -vlnv xilinx.com:display_jesd204:jesd204_rx_bus_rtl:1.0 rx_phy0
create_bd_intf_pin -mode Slave -vlnv xilinx.com:display_jesd204:jesd204_rx_bus_rtl:1.0 rx_phy1
create_bd_intf_pin -mode Slave -vlnv xilinx.com:display_jesd204:jesd204_rx_bus_rtl:1.0 rx_phy2
create_bd_intf_pin -mode Slave -vlnv xilinx.com:display_jesd204:jesd204_rx_bus_rtl:1.0 rx_phy3
create_bd_pin -dir I -type clk s_axi_aclk
create_bd_pin -dir I -type rst s_axi_aresetn
create_bd_pin -dir O -type intr irq
create_bd_pin -dir I -type clk device_clk
create_bd_pin -dir O -from 0 -to 0 sync
create_bd_pin -dir I sysref
create_bd_pin -dir O phy_en_char_align
create_bd_pin -dir O -from 3 -to 0 rx_eof
create_bd_pin -dir O -from 3 -to 0 rx_sof
create_bd_pin -dir O rx_data_tvalid
create_bd_pin -dir O -from 127 -to 0 rx_data_tdata
create_bd_pin -dir O lmfc_clk_0
create_bd_pin -dir O lmfc_edge_0

create_bd_cell -type ip -vlnv analog.com:user:axi_jesd204_rx:1.0 rx_axi
set_property -dict {CONFIG.NUM_LANES 4 CONFIG.NUM_LINKS 1} [get_bd_cells rx_axi]
create_bd_cell -type ip -vlnv analog.com:user:jesd204_rx:1.0 rx
set_property -dict {CONFIG.NUM_LANES 4 CONFIG.NUM_LINKS 1} [get_bd_cells rx]

# ---- connections ----

current_bd_instance /axi_ad9680_jesd
connect_bd_intf_net [get_bd_intf_pins rx_axi/rx_cfg] [get_bd_intf_pins rx/rx_cfg]
connect_bd_intf_net [get_bd_intf_pins rx/rx_event] [get_bd_intf_pins rx_axi/rx_event]
connect_bd_intf_net [get_bd_intf_pins rx/rx_status] [get_bd_intf_pins rx_axi/rx_status]
connect_bd_intf_net [get_bd_intf_pins rx/rx_ilas_config] [get_bd_intf_pins rx_axi/rx_ilas_config]
connect_bd_intf_net [get_bd_intf_pins s_axi] [get_bd_intf_pins rx_axi/s_axi]
connect_bd_intf_net -intf_net rx_phy0_1 [get_bd_intf_pins rx_phy0] [get_bd_intf_pins rx/rx_phy0]
connect_bd_intf_net -intf_net rx_phy1_1 [get_bd_intf_pins rx_phy1] [get_bd_intf_pins rx/rx_phy1]
connect_bd_intf_net -intf_net rx_phy2_1 [get_bd_intf_pins rx_phy2] [get_bd_intf_pins rx/rx_phy2]
connect_bd_intf_net -intf_net rx_phy3_1 [get_bd_intf_pins rx_phy3] [get_bd_intf_pins rx/rx_phy3]
connect_bd_net [get_bd_pins rx_axi/core_reset] [get_bd_pins rx/reset]
connect_bd_net [get_bd_pins s_axi_aclk] [get_bd_pins rx_axi/s_axi_aclk]
connect_bd_net [get_bd_pins s_axi_aresetn] [get_bd_pins rx_axi/s_axi_aresetn]
connect_bd_net [get_bd_pins rx_axi/irq] [get_bd_pins irq]
connect_bd_net [get_bd_pins device_clk] [get_bd_pins rx_axi/core_clk] [get_bd_pins rx/clk]
connect_bd_net [get_bd_pins rx/sync] [get_bd_pins sync]
connect_bd_net [get_bd_pins sysref] [get_bd_pins rx/sysref]
connect_bd_net [get_bd_pins rx/phy_en_char_align] [get_bd_pins phy_en_char_align]
connect_bd_net [get_bd_pins rx/rx_data] [get_bd_pins rx_data_tdata]
connect_bd_net [get_bd_pins rx/rx_valid] [get_bd_pins rx_data_tvalid]
connect_bd_net [get_bd_pins rx/rx_eof] [get_bd_pins rx_eof]
connect_bd_net [get_bd_pins rx/rx_sof] [get_bd_pins rx_sof]
connect_bd_net [get_bd_pins rx/lmfc_clk] [get_bd_pins lmfc_clk_0]
connect_bd_net [get_bd_pins rx/lmfc_edge] [get_bd_pins lmfc_edge_0]

current_bd_instance /
connect_bd_intf_net [get_bd_intf_pins axi_ad9680_xcvr/up_es_0] [get_bd_intf_pins util_daq2_xcvr/up_es_0]
connect_bd_intf_net [get_bd_intf_pins axi_ad9680_xcvr/up_ch_0] [get_bd_intf_pins util_daq2_xcvr/up_rx_0]
connect_bd_intf_net [get_bd_intf_pins util_daq2_xcvr/rx_0] [get_bd_intf_pins axi_ad9680_jesd/rx_phy0]
connect_bd_intf_net [get_bd_intf_pins axi_ad9680_xcvr/up_es_1] [get_bd_intf_pins util_daq2_xcvr/up_es_1]
connect_bd_intf_net [get_bd_intf_pins axi_ad9680_xcvr/up_ch_1] [get_bd_intf_pins util_daq2_xcvr/up_rx_1]
connect_bd_intf_net [get_bd_intf_pins util_daq2_xcvr/rx_1] [get_bd_intf_pins axi_ad9680_jesd/rx_phy1]
connect_bd_intf_net [get_bd_intf_pins axi_ad9680_xcvr/up_es_2] [get_bd_intf_pins util_daq2_xcvr/up_es_2]
connect_bd_intf_net [get_bd_intf_pins axi_ad9680_xcvr/up_ch_2] [get_bd_intf_pins util_daq2_xcvr/up_rx_2]
connect_bd_intf_net [get_bd_intf_pins util_daq2_xcvr/rx_2] [get_bd_intf_pins axi_ad9680_jesd/rx_phy2]
connect_bd_intf_net [get_bd_intf_pins axi_ad9680_xcvr/up_es_3] [get_bd_intf_pins util_daq2_xcvr/up_es_3]
connect_bd_intf_net [get_bd_intf_pins axi_ad9680_xcvr/up_ch_3] [get_bd_intf_pins util_daq2_xcvr/up_rx_3]
connect_bd_intf_net [get_bd_intf_pins util_daq2_xcvr/rx_3] [get_bd_intf_pins axi_ad9680_jesd/rx_phy3]
connect_bd_intf_net [get_bd_intf_pins axi_cpu_interconnect/S00_AXI] [get_bd_intf_pins sys_ps8/M_AXI_HPM0_LPD]
connect_bd_intf_net [get_bd_intf_pins axi_cpu_interconnect/M04_AXI] [get_bd_intf_pins axi_ad9680_xcvr/s_axi]
connect_bd_intf_net [get_bd_intf_pins axi_cpu_interconnect/M05_AXI] [get_bd_intf_pins axi_ad9680_core/s_axi]
connect_bd_intf_net [get_bd_intf_pins axi_cpu_interconnect/M06_AXI] [get_bd_intf_pins axi_ad9680_jesd/s_axi]
connect_bd_intf_net [get_bd_intf_pins axi_cpu_interconnect/M07_AXI] [get_bd_intf_pins axi_ad9680_dma/s_axi]
connect_bd_intf_net [get_bd_intf_pins axi_hp3_interconnect/M00_AXI] [get_bd_intf_pins sys_ps8/S_AXI_HP3_FPD]
connect_bd_intf_net [get_bd_intf_pins axi_hp3_interconnect/S00_AXI] [get_bd_intf_pins axi_ad9680_xcvr/m_axi]
connect_bd_intf_net [get_bd_intf_pins axi_hp2_interconnect/M00_AXI] [get_bd_intf_pins sys_ps8/S_AXI_HP2_FPD]
connect_bd_intf_net [get_bd_intf_pins axi_hp2_interconnect/S00_AXI] [get_bd_intf_pins axi_ad9680_dma/m_dest_axi]
connect_bd_net -net sys_cpu_clk [get_bd_pins sys_ps8/pl_clk0] \
  [get_bd_pins sys_rstgen/slowest_sync_clk] [get_bd_pins util_daq2_xcvr/up_clk] [get_bd_pins axi_ad9680_fifo/dma_clk] \
  [get_bd_pins axi_ad9680_dma/s_axis_aclk] [get_bd_pins sys_ps8/maxihpm0_lpd_aclk] [get_bd_pins axi_ad9680_xcvr/s_axi_aclk] \
  [get_bd_pins axi_ad9680_core/s_axi_aclk] [get_bd_pins axi_ad9680_dma/s_axi_aclk] [get_bd_pins sys_ps8/saxihp3_fpd_aclk] \
  [get_bd_pins sys_ps8/saxihp1_fpd_aclk] [get_bd_pins sys_ps8/saxihp2_fpd_aclk] [get_bd_pins axi_ad9680_dma/m_dest_axi_aclk] \
  [get_bd_pins axi_cpu_interconnect/ACLK] [get_bd_pins axi_cpu_interconnect/S00_ACLK] \
  [get_bd_pins axi_cpu_interconnect/M00_ACLK] [get_bd_pins axi_cpu_interconnect/M01_ACLK] \
  [get_bd_pins axi_cpu_interconnect/M02_ACLK] [get_bd_pins axi_cpu_interconnect/M03_ACLK] \
  [get_bd_pins axi_cpu_interconnect/M04_ACLK] [get_bd_pins axi_cpu_interconnect/M05_ACLK] \
  [get_bd_pins axi_cpu_interconnect/M06_ACLK] [get_bd_pins axi_ad9680_jesd/s_axi_aclk] \
  [get_bd_pins axi_cpu_interconnect/M07_ACLK] [get_bd_pins axi_hp3_interconnect/ACLK] \
  [get_bd_pins axi_hp3_interconnect/M00_ACLK] [get_bd_pins axi_hp3_interconnect/S00_ACLK] \
  [get_bd_pins axi_hp2_interconnect/ACLK] [get_bd_pins axi_hp2_interconnect/M00_ACLK] \
  [get_bd_pins axi_hp2_interconnect/S00_ACLK]
# net sys_200m_clk has one end: sys_ps8/pl_clk1
connect_bd_net -net sys_cpu_resetn [get_bd_pins sys_rstgen/peripheral_aresetn] \
  [get_bd_pins util_daq2_xcvr/up_rstn] [get_bd_pins axi_ad9680_jesd_rstgen/ext_reset_in] \
  [get_bd_pins axi_ad9680_dma/m_dest_axi_aresetn] [get_bd_pins axi_ad9680_xcvr/s_axi_aresetn] \
  [get_bd_pins axi_ad9680_core/s_axi_aresetn] [get_bd_pins axi_ad9680_dma/s_axi_aresetn] [get_bd_pins clk_wiz_0/resetn] \
  [get_bd_pins axi_cpu_interconnect/ARESETN] [get_bd_pins axi_cpu_interconnect/S00_ARESETN] \
  [get_bd_pins axi_cpu_interconnect/M00_ARESETN] [get_bd_pins axi_cpu_interconnect/M01_ARESETN] \
  [get_bd_pins axi_cpu_interconnect/M02_ARESETN] [get_bd_pins axi_cpu_interconnect/M03_ARESETN] \
  [get_bd_pins axi_cpu_interconnect/M04_ARESETN] [get_bd_pins axi_cpu_interconnect/M05_ARESETN] \
  [get_bd_pins axi_cpu_interconnect/M06_ARESETN] [get_bd_pins axi_ad9680_jesd/s_axi_aresetn] \
  [get_bd_pins axi_cpu_interconnect/M07_ARESETN] [get_bd_pins axi_hp3_interconnect/ARESETN] \
  [get_bd_pins axi_hp3_interconnect/M00_ARESETN] [get_bd_pins axi_hp3_interconnect/S00_ARESETN] \
  [get_bd_pins axi_hp2_interconnect/ARESETN] [get_bd_pins axi_hp2_interconnect/M00_ARESETN] \
  [get_bd_pins axi_hp2_interconnect/S00_ARESETN]
connect_bd_net [get_bd_pins sys_ps8/pl_resetn0] [get_bd_pins sys_rstgen/ext_reset_in]
connect_bd_net [get_bd_ports gpio_i] [get_bd_pins sys_ps8/emio_gpio_i]
connect_bd_net [get_bd_pins sys_ps8/emio_gpio_o] [get_bd_ports gpio_o]
connect_bd_net [get_bd_pins sys_ps8/emio_gpio_t] [get_bd_ports gpio_t]
connect_bd_net [get_bd_pins sys_ps8/emio_spi0_ss_o_n] [get_bd_pins spi0_csn_concat/In0]
connect_bd_net [get_bd_pins sys_ps8/emio_spi0_ss1_o_n] [get_bd_pins spi0_csn_concat/In1]
connect_bd_net [get_bd_pins sys_ps8/emio_spi0_ss2_o_n] [get_bd_pins spi0_csn_concat/In2]
connect_bd_net [get_bd_pins spi0_csn_concat/dout] [get_bd_ports spi0_csn]
connect_bd_net [get_bd_pins sys_ps8/emio_spi0_sclk_o] [get_bd_ports spi0_sclk]
connect_bd_net [get_bd_pins sys_ps8/emio_spi0_m_o] [get_bd_ports spi0_mosi]
connect_bd_net [get_bd_ports spi0_miso] [get_bd_pins sys_ps8/emio_spi0_m_i]
connect_bd_net [get_bd_pins sys_ps8_emio_spi0_ss_i_n_VCC/dout] [get_bd_pins sys_ps8/emio_spi0_ss_i_n]
connect_bd_net [get_bd_pins sys_ps8_emio_spi0_sclk_i_GND/dout] [get_bd_pins sys_ps8/emio_spi0_sclk_i]
connect_bd_net [get_bd_pins sys_ps8_emio_spi0_s_i_GND/dout] [get_bd_pins sys_ps8/emio_spi0_s_i]
connect_bd_net [get_bd_pins sys_ps8/emio_spi1_ss_o_n] [get_bd_pins spi1_csn_concat/In0]
connect_bd_net [get_bd_pins sys_ps8/emio_spi1_ss1_o_n] [get_bd_pins spi1_csn_concat/In1]
connect_bd_net [get_bd_pins sys_ps8/emio_spi1_ss2_o_n] [get_bd_pins spi1_csn_concat/In2]
connect_bd_net [get_bd_pins spi1_csn_concat/dout] [get_bd_ports spi1_csn]
connect_bd_net [get_bd_pins sys_ps8/emio_spi1_sclk_o] [get_bd_ports spi1_sclk]
connect_bd_net [get_bd_pins sys_ps8/emio_spi1_m_o] [get_bd_ports spi1_mosi]
connect_bd_net [get_bd_ports spi1_miso] [get_bd_pins sys_ps8/emio_spi1_m_i]
connect_bd_net [get_bd_pins sys_ps8_emio_spi1_ss_i_n_VCC/dout] [get_bd_pins sys_ps8/emio_spi1_ss_i_n]
connect_bd_net [get_bd_pins sys_ps8_emio_spi1_sclk_i_GND/dout] [get_bd_pins sys_ps8/emio_spi1_sclk_i]
connect_bd_net [get_bd_pins sys_ps8_emio_spi1_s_i_GND/dout] [get_bd_pins sys_ps8/emio_spi1_s_i]
connect_bd_net [get_bd_pins sys_concat_intc_0/dout] [get_bd_pins sys_ps8/pl_ps_irq0]
connect_bd_net [get_bd_pins sys_concat_intc_1/dout] [get_bd_pins sys_ps8/pl_ps_irq1]
connect_bd_net -net ps_intr_15_1 [get_bd_ports ps_intr_15] [get_bd_pins sys_concat_intc_1/In7]
connect_bd_net -net ps_intr_14_1 [get_bd_ports ps_intr_14] [get_bd_pins sys_concat_intc_1/In6]
connect_bd_net -net ps_intr_09_1 [get_bd_ports ps_intr_09] [get_bd_pins sys_concat_intc_1/In1]
connect_bd_net -net ps_intr_08_1 [get_bd_ports ps_intr_08] [get_bd_pins sys_concat_intc_1/In0]
connect_bd_net -net ps_intr_07_1 [get_bd_ports ps_intr_07] [get_bd_pins sys_concat_intc_0/In7]
connect_bd_net -net ps_intr_06_1 [get_bd_ports ps_intr_06] [get_bd_pins sys_concat_intc_0/In6]
connect_bd_net -net ps_intr_05_1 [get_bd_ports ps_intr_05] [get_bd_pins sys_concat_intc_0/In5]
connect_bd_net -net ps_intr_04_1 [get_bd_ports ps_intr_04] [get_bd_pins sys_concat_intc_0/In4]
connect_bd_net -net ps_intr_03_1 [get_bd_ports ps_intr_03] [get_bd_pins sys_concat_intc_0/In3]
connect_bd_net -net ps_intr_02_1 [get_bd_ports ps_intr_02] [get_bd_pins sys_concat_intc_0/In2]
connect_bd_net -net ps_intr_01_1 [get_bd_ports ps_intr_01] [get_bd_pins sys_concat_intc_0/In1]
connect_bd_net -net ps_intr_00_1 [get_bd_ports ps_intr_00] [get_bd_pins sys_concat_intc_0/In0]
connect_bd_net -net rx_ref_clk_0_1 [get_bd_ports rx_ref_clk_0] \
  [get_bd_pins util_daq2_xcvr/cpll_ref_clk_0] [get_bd_pins util_daq2_xcvr/cpll_ref_clk_1] \
  [get_bd_pins util_daq2_xcvr/cpll_ref_clk_2] [get_bd_pins util_daq2_xcvr/cpll_ref_clk_3] \
  [get_bd_pins util_daq2_xcvr/qpll_ref_clk_0]
connect_bd_net [get_bd_pins axi_ad9680_xcvr/up_pll_rst] \
  [get_bd_pins util_daq2_xcvr/up_cpll_rst_0] [get_bd_pins util_daq2_xcvr/up_cpll_rst_1] \
  [get_bd_pins util_daq2_xcvr/up_cpll_rst_2] [get_bd_pins util_daq2_xcvr/up_cpll_rst_3] \
  [get_bd_pins util_daq2_xcvr/up_qpll_rst_0]
connect_bd_net [get_bd_pins util_daq2_xcvr/tx_out_clk_0] \
  [get_bd_pins util_daq2_xcvr/tx_clk_0] [get_bd_pins util_daq2_xcvr/tx_clk_1] [get_bd_pins util_daq2_xcvr/tx_clk_2] \
  [get_bd_pins util_daq2_xcvr/tx_clk_3]
connect_bd_net [get_bd_pins util_daq2_xcvr/tx_3_p] [get_bd_ports tx_data_3_p]
connect_bd_net [get_bd_pins util_daq2_xcvr/tx_3_n] [get_bd_ports tx_data_3_n]
connect_bd_net [get_bd_pins axi_ad9680_jesd/phy_en_char_align] \
  [get_bd_pins util_daq2_xcvr/rx_calign_0] [get_bd_pins util_daq2_xcvr/rx_calign_1] [get_bd_pins util_daq2_xcvr/rx_calign_2] \
  [get_bd_pins util_daq2_xcvr/rx_calign_3]
connect_bd_net [get_bd_pins util_daq2_xcvr/rx_out_clk_0] \
  [get_bd_ports rx_out_clk] [get_bd_pins util_daq2_xcvr/rx_clk_0] [get_bd_pins util_daq2_xcvr/rx_clk_1] \
  [get_bd_pins util_daq2_xcvr/rx_clk_2] [get_bd_pins util_daq2_xcvr/rx_clk_3] \
  [get_bd_pins axi_ad9680_jesd_rstgen/slowest_sync_clk] [get_bd_pins axi_ad9680_core/rx_clk] \
  [get_bd_pins axi_ad9680_cpack/adc_clk] [get_bd_pins axi_ad9680_fifo/adc_clk] [get_bd_pins ila_0/clk] \
  [get_bd_pins format_9234_timestamp_0/clk] [get_bd_pins format_9234_timestamp_0/clk_2x] [get_bd_pins start_LD_0/clk] \
  [get_bd_pins axi_ad9680_jesd/device_clk]
connect_bd_net [get_bd_ports rx_data_0_p] [get_bd_pins util_daq2_xcvr/rx_0_p]
connect_bd_net [get_bd_ports rx_data_0_n] [get_bd_pins util_daq2_xcvr/rx_0_n]
connect_bd_net [get_bd_ports rx_data_1_p] [get_bd_pins util_daq2_xcvr/rx_1_p]
connect_bd_net [get_bd_ports rx_data_1_n] [get_bd_pins util_daq2_xcvr/rx_1_n]
connect_bd_net [get_bd_ports rx_data_2_p] [get_bd_pins util_daq2_xcvr/rx_2_p]
connect_bd_net [get_bd_ports rx_data_2_n] [get_bd_pins util_daq2_xcvr/rx_2_n]
connect_bd_net [get_bd_ports rx_data_3_p] [get_bd_pins util_daq2_xcvr/rx_3_p]
connect_bd_net [get_bd_ports rx_data_3_n] [get_bd_pins util_daq2_xcvr/rx_3_n]
connect_bd_net -net sysref_2 [get_bd_ports rx_sysref_0] [get_bd_pins axi_ad9680_jesd/sysref]
connect_bd_net [get_bd_pins axi_ad9680_jesd/sync] [get_bd_ports rx_sync_0]
connect_bd_net [get_bd_pins axi_ad9680_jesd/rx_sof] [get_bd_pins axi_ad9680_core/rx_sof]
connect_bd_net [get_bd_pins axi_ad9680_jesd/rx_data_tdata] [get_bd_pins axi_ad9680_core/rx_data]
connect_bd_net [get_bd_pins axi_ad9680_jesd_rstgen/peripheral_reset] [get_bd_pins axi_ad9680_cpack/adc_rst] [get_bd_pins axi_ad9680_fifo/adc_rst]
connect_bd_net [get_bd_pins axi_ad9680_core/adc_enable_0] [get_bd_pins format_9234_timestamp_0/i_adc_enable_0]
connect_bd_net [get_bd_pins axi_ad9680_core/adc_valid_0] [get_bd_pins format_9234_timestamp_0/i_adc_valid_0]
connect_bd_net [get_bd_pins axi_ad9680_core/adc_data_0] [get_bd_pins ila_0/probe10] [get_bd_pins format_9234_timestamp_0/in_0]
connect_bd_net [get_bd_pins axi_ad9680_core/adc_enable_1] [get_bd_pins format_9234_timestamp_0/i_adc_enable_1]
connect_bd_net [get_bd_pins axi_ad9680_core/adc_valid_1] [get_bd_pins format_9234_timestamp_0/i_adc_valid_1]
connect_bd_net [get_bd_pins axi_ad9680_core/adc_data_1] [get_bd_pins ila_0/probe11] [get_bd_pins format_9234_timestamp_0/in_1]
connect_bd_net [get_bd_pins axi_ad9680_cpack/adc_valid] [get_bd_pins axi_ad9680_fifo/adc_wr]
connect_bd_net [get_bd_pins axi_ad9680_cpack/adc_data] [get_bd_pins axi_ad9680_fifo/adc_wdata]
connect_bd_net [get_bd_pins axi_ad9680_fifo/dma_wr] [get_bd_pins axi_ad9680_dma/s_axis_valid]
connect_bd_net [get_bd_pins axi_ad9680_fifo/dma_wdata] [get_bd_pins axi_ad9680_dma/s_axis_data]
connect_bd_net [get_bd_pins axi_ad9680_dma/s_axis_ready] [get_bd_pins axi_ad9680_fifo/dma_wready]
connect_bd_net [get_bd_pins axi_ad9680_dma/s_axis_xfer_req] [get_bd_pins axi_ad9680_fifo/dma_xfer_req]
connect_bd_net [get_bd_pins axi_ad9680_fifo/adc_wovf] [get_bd_pins axi_ad9680_core/adc_dovf]
connect_bd_net [get_bd_pins axi_ad9680_jesd/irq] [get_bd_pins sys_concat_intc_1/In3]
connect_bd_net [get_bd_pins axi_ad9680_dma/irq] [get_bd_pins sys_concat_intc_1/In5]
connect_bd_net [get_bd_pins start_LD_0/start1] [get_bd_ports start1] [get_bd_pins ila_0/probe0] [get_bd_pins format_9234_timestamp_0/trig]
connect_bd_net [get_bd_pins util_daq2_xcvr/tx_2_n] [get_bd_ports tx_data_2_n]
connect_bd_net [get_bd_pins util_daq2_xcvr/tx_2_p] [get_bd_ports tx_data_2_p]
connect_bd_net [get_bd_pins util_daq2_xcvr/tx_1_n] [get_bd_ports tx_data_1_n]
connect_bd_net [get_bd_pins util_daq2_xcvr/tx_1_p] [get_bd_ports tx_data_1_p]
connect_bd_net [get_bd_pins util_daq2_xcvr/tx_0_n] [get_bd_ports tx_data_0_n]
connect_bd_net [get_bd_pins util_daq2_xcvr/tx_0_p] [get_bd_ports tx_data_0_p]
connect_bd_net [get_bd_pins clk_wiz_0/clk_out200M] [get_bd_ports clk_out200M]
connect_bd_net -net clk_in1_0_1 [get_bd_ports clk_in1_0] [get_bd_pins clk_wiz_0/clk_in1]
connect_bd_net [get_bd_pins format_9234_timestamp_0/o_adc_enable_0] [get_bd_pins axi_ad9680_cpack/adc_enable_0] [get_bd_pins ila_0/probe8]
connect_bd_net [get_bd_pins format_9234_timestamp_0/o_adc_enable_1] [get_bd_pins axi_ad9680_cpack/adc_enable_1] [get_bd_pins ila_0/probe9]
connect_bd_net [get_bd_pins format_9234_timestamp_0/o_adc_valid_0] [get_bd_pins axi_ad9680_cpack/adc_valid_0] [get_bd_pins ila_0/probe6]
connect_bd_net [get_bd_pins format_9234_timestamp_0/o_adc_valid_1] [get_bd_pins axi_ad9680_cpack/adc_valid_1] [get_bd_pins ila_0/probe7]
connect_bd_net [get_bd_pins format_9234_timestamp_0/out_1] [get_bd_pins axi_ad9680_cpack/adc_data_1] [get_bd_pins ila_0/probe2]
connect_bd_net [get_bd_pins format_9234_timestamp_0/out_0] [get_bd_pins axi_ad9680_cpack/adc_data_0] [get_bd_pins ila_0/probe1]
connect_bd_net [get_bd_pins format_9234_timestamp_0/waveform_0] [get_bd_pins ila_0/probe3]
connect_bd_net [get_bd_pins format_9234_timestamp_0/waveform_1] [get_bd_pins ila_0/probe4]
connect_bd_net [get_bd_pins format_9234_timestamp_0/o_ps_irq] [get_bd_pins sys_concat_intc_1/In2] [get_bd_pins ila_0/probe5]
connect_bd_net [get_bd_pins axi_ad9680_jesd_rstgen/peripheral_aresetn] [get_bd_pins format_9234_timestamp_0/rst_n]
connect_bd_net [get_bd_pins sys_ps8_emio_spi1_ss_i_n_VCC1/dout] [get_bd_pins start_LD_0/rst_n]
connect_bd_net [get_bd_pins axi_ad9680_jesd/lmfc_clk_0] [get_bd_ports lmfc_clk]
connect_bd_net [get_bd_pins axi_ad9680_jesd/lmfc_edge_0] [get_bd_ports lmfc_edge]

# ---- address map ----
assign_bd_address -offset 0x00000000 -range 2G -target_address_space [get_bd_addr_spaces axi_ad9680_dma/m_dest_axi] [get_bd_addr_segs sys_ps8/SAXIGP4/HP2_DDR_LOW]
assign_bd_address -offset 0xC0000000 -range 512M -target_address_space [get_bd_addr_spaces axi_ad9680_dma/m_dest_axi] [get_bd_addr_segs sys_ps8/SAXIGP4/HP2_QSPI]
assign_bd_address -offset 0xE0000000 -range 256M -target_address_space [get_bd_addr_spaces axi_ad9680_dma/m_dest_axi] [get_bd_addr_segs sys_ps8/SAXIGP4/HP2_PCIE_LOW]
assign_bd_address -offset 0xFF000000 -range 16M -target_address_space [get_bd_addr_spaces axi_ad9680_dma/m_dest_axi] [get_bd_addr_segs sys_ps8/SAXIGP4/HP2_LPS_OCM]
assign_bd_address -offset 0x00000000 -range 2G -target_address_space [get_bd_addr_spaces axi_ad9680_xcvr/m_axi] [get_bd_addr_segs sys_ps8/SAXIGP5/HP3_DDR_LOW]
assign_bd_address -offset 0xC0000000 -range 512M -target_address_space [get_bd_addr_spaces axi_ad9680_xcvr/m_axi] [get_bd_addr_segs sys_ps8/SAXIGP5/HP3_QSPI]
assign_bd_address -offset 0xE0000000 -range 256M -target_address_space [get_bd_addr_spaces axi_ad9680_xcvr/m_axi] [get_bd_addr_segs sys_ps8/SAXIGP5/HP3_PCIE_LOW]
assign_bd_address -offset 0xFF000000 -range 16M -target_address_space [get_bd_addr_spaces axi_ad9680_xcvr/m_axi] [get_bd_addr_segs sys_ps8/SAXIGP5/HP3_LPS_OCM]
assign_bd_address -offset 0x00084A10000 -range 64K -target_address_space [get_bd_addr_spaces sys_ps8/Data] [get_bd_addr_segs axi_ad9680_core/s_axi/axi_lite]
assign_bd_address -offset 0x00084A50000 -range 64K -target_address_space [get_bd_addr_spaces sys_ps8/Data] [get_bd_addr_segs axi_ad9680_xcvr/s_axi/axi_lite]
assign_bd_address -offset 0x00084AA0000 -range 16K -target_address_space [get_bd_addr_spaces sys_ps8/Data] [get_bd_addr_segs axi_ad9680_jesd/rx_axi/s_axi/axi_lite]
assign_bd_address -offset 0x0009C400000 -range 4K -target_address_space [get_bd_addr_spaces sys_ps8/Data] [get_bd_addr_segs axi_ad9680_dma/s_axi/axi_lite]

validate_bd_design
save_bd_design
